# Altium schematic sheet Design Notes.SchDoc
size B; Organization: ToyBuilder Labs; Address1: 1100 S Garfield Avenue; Address2: Alhambra, CA 91801; Address4: +1 (626) 808-4010; SheetNumber: 3; SheetTotal: 3
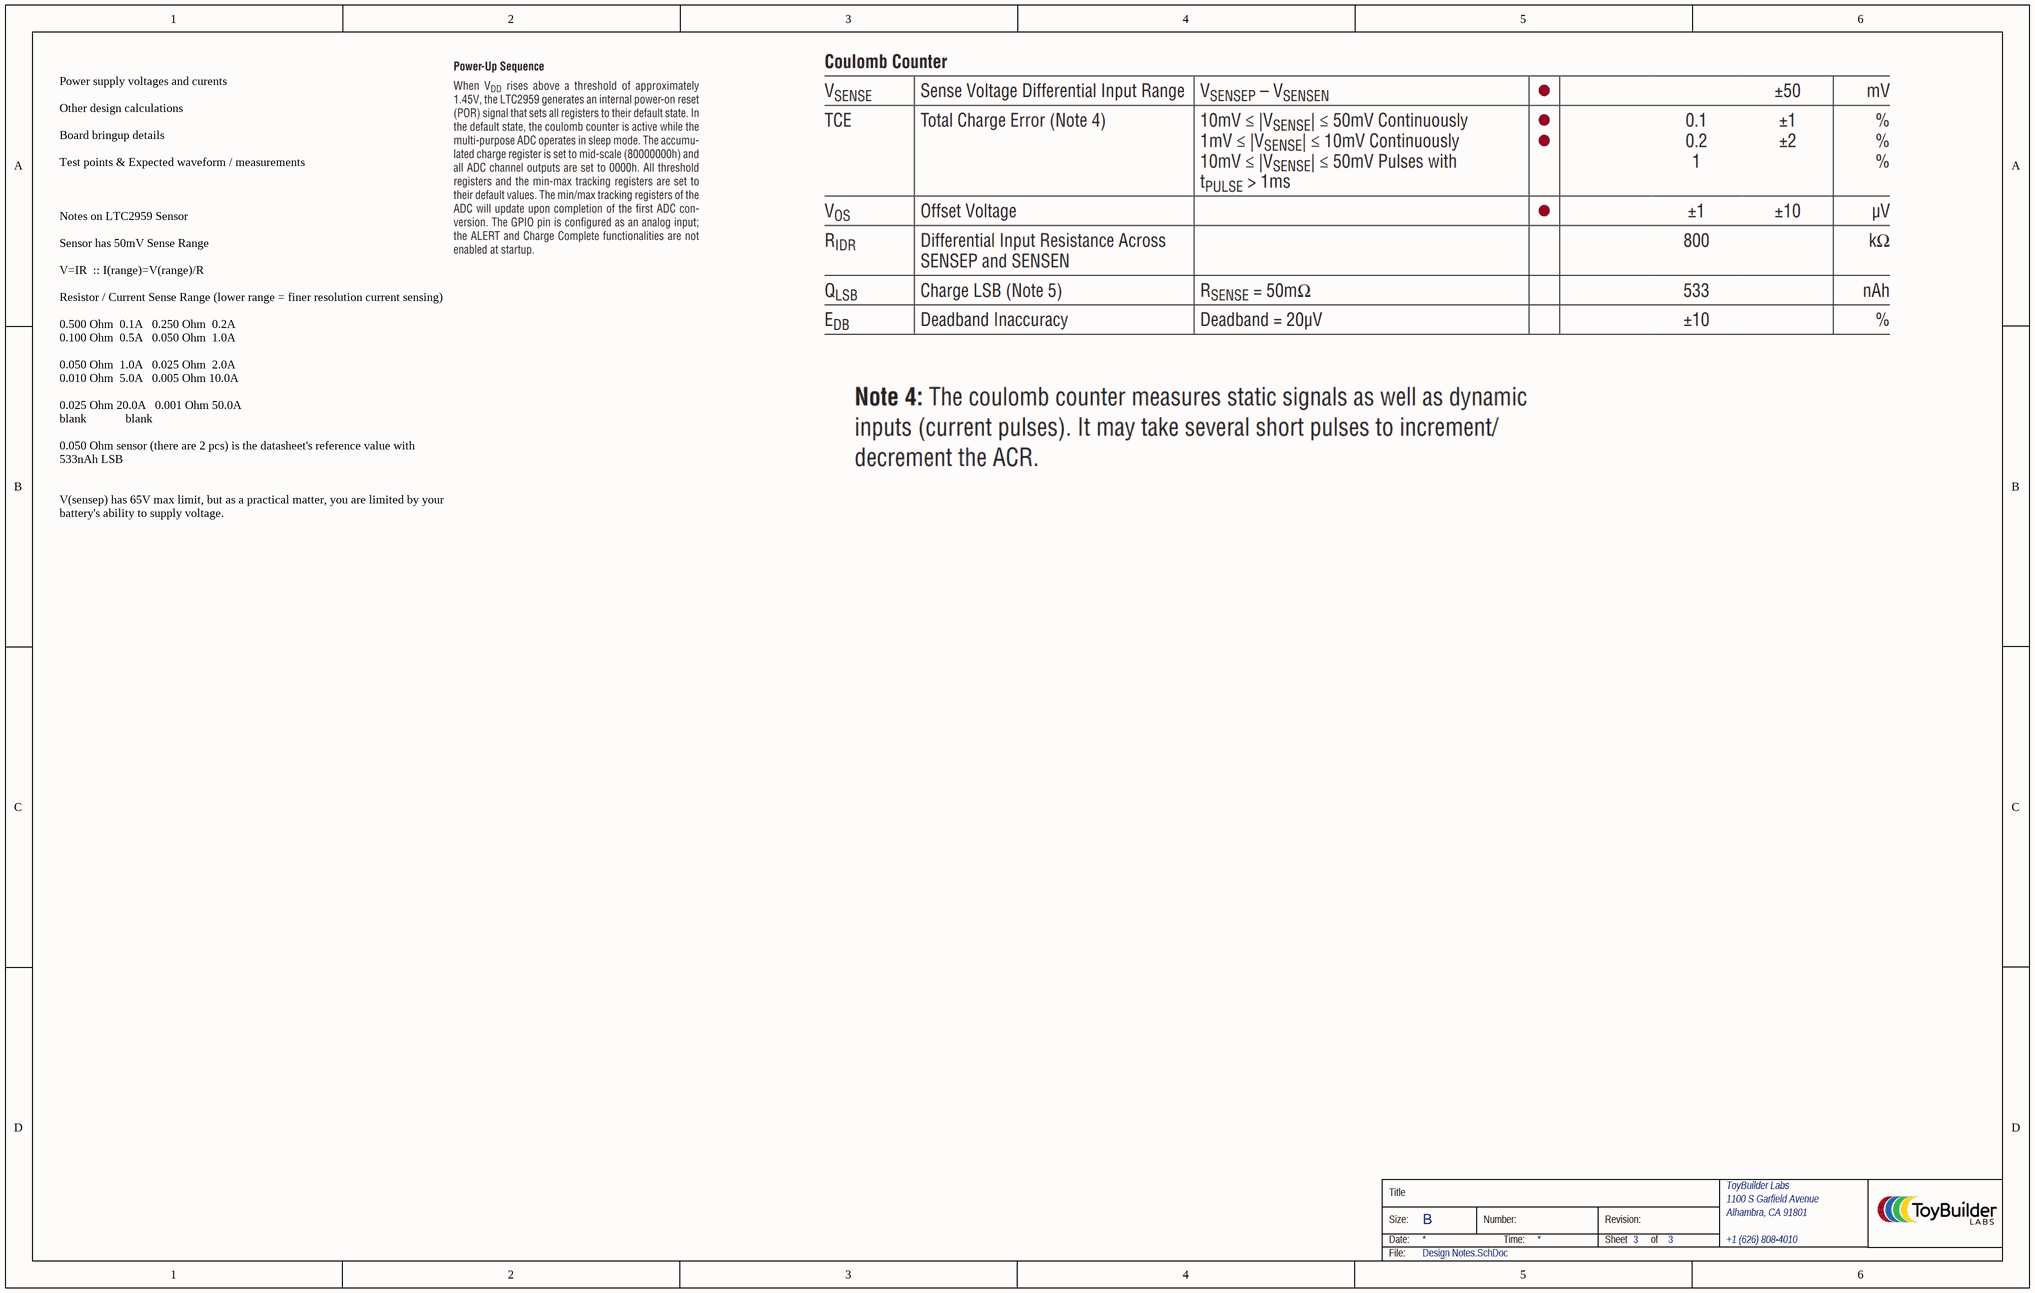
[diagram p0: Design Notes.SchDoc]

## Notes on the sheet
- Power supply voltages and curents
  Other design calculations
  Board bringup details
  Test points & Expected waveform / measurements
  Notes on LTC2959 Sensor
  Sensor has 50mV Sense Range
  V=IR  :: I(range)=V(range)/R
  Resistor / Current Sense Range (lower range = finer resolution current sensing)
  0.500 Ohm  0.1A   0.250 Ohm  0.2A
  0.100 Ohm  0.5A   0.050 Ohm  1.0A
  0.050 Ohm  1.0A   0.025 Ohm  2.0A
  0.010 Ohm  5.0A   0.005 Ohm 10.0A
  0.025 Ohm 20.0A   0.001 Ohm 50.0A
  blank             blank
  0.050 Ohm sensor (there are 2 pcs) is the datasheet's reference value with 533nAh LSB
  V(sensep) has 65V max limit, but as a practical matter, you are limited by your battery's ability to supply voltage.
- Title
- Size:
- Date:
- B
- Number:
- Time:
- Revision:
- Sheet
- of
- File: